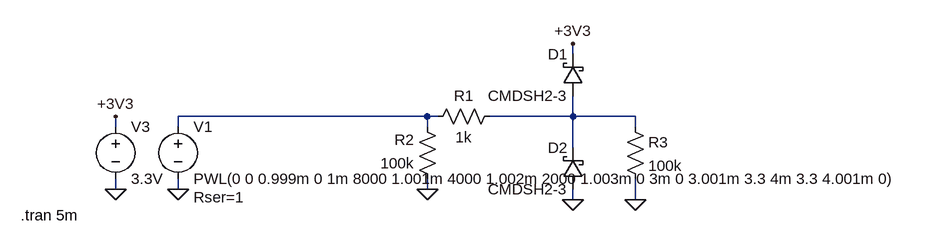
[diagram p0: schematic esd_io_0_1.asc]
esd_io_0_1.asc, the LTspice schematic file:
Version 4
SHEET 1 1400 680
WIRE 752 32 752 16
WIRE 528 128 144 128
WIRE 544 128 528 128
WIRE 752 128 752 96
WIRE 752 128 624 128
WIRE 848 128 752 128
WIRE 48 144 48 128
WIRE 144 144 144 128
WIRE 528 144 528 128
WIRE 848 144 848 128
WIRE 752 176 752 128
WIRE 48 240 48 224
WIRE 144 240 144 224
WIRE 528 240 528 224
WIRE 752 256 752 240
WIRE 848 256 848 224
FLAG 144 240 0
FLAG 528 240 0
FLAG 48 240 0
FLAG 48 128 +3V3
FLAG 752 16 +3V3
FLAG 752 256 0
FLAG 848 256 0
SYMBOL voltage 144 128 R0
WINDOW 123 0 0 Left 2
WINDOW 39 24 124 Left 2
SYMATTR InstName V1
SYMATTR Value PWL(0 0 0.999m 0 1m 8000 1.001m 4000 1.002m 2000 1.003m 0 3m 0 3.001m 3.3 4m 3.3 4.001m 0)
SYMATTR SpiceLine Rser=1
SYMBOL schottky 768 240 R180
WINDOW 0 24 64 Left 2
WINDOW 3 24 0 Left 2
SYMATTR InstName D2
SYMATTR Value CMDSH2-3
SYMBOL res 640 112 R90
WINDOW 0 0 56 VBottom 2
WINDOW 3 32 56 VTop 2
SYMATTR InstName R1
SYMATTR Value 1k
SYMBOL res 544 240 R180
WINDOW 0 36 76 Left 2
WINDOW 3 36 40 Left 2
SYMATTR InstName R2
SYMATTR Value 100k
SYMBOL schottky 768 96 R180
WINDOW 0 24 64 Left 2
WINDOW 3 24 0 Left 2
SYMATTR InstName D1
SYMATTR Value CMDSH2-3
SYMBOL voltage 48 128 R0
WINDOW 123 0 0 Left 2
WINDOW 39 0 0 Left 2
SYMATTR InstName V3
SYMATTR Value 3.3V
SYMBOL res 832 128 R0
SYMATTR InstName R3
SYMATTR Value 100k
TEXT -98 280 Left 2 !.tran 5m

The netlist it stands for:
* esd_io_0_1.asc
V1 N001 0 PWL(0 0 0.999m 0 1m 8000 1.001m 4000 1.002m 2000 1.003m 0 3m 0 3.001m 3.3 4m 3.3 4.001m 0) Rser=1
D2 0 N002 CMDSH2-3
R1 N002 N001 1k
R2 0 N001 100k
D1 N002 +3V3 CMDSH2-3
V3 +3V3 0 3.3V
R3 N002 0 100k
.model D D
.lib standard.dio
.tran 5m
.backanno
.end